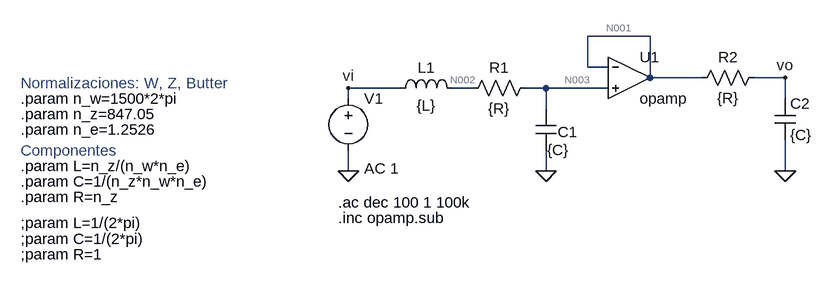
[diagram p0: schematic Tp-Semana3.asc]
Tp-Semana3.asc, the LTspice schematic file:
Version 4
SHEET 1 880 680
WIRE 288 64 192 64
WIRE 192 112 192 64
WIRE 224 112 192 112
WIRE 288 128 288 64
WIRE 368 128 288 128
WIRE 496 128 448 128
WIRE -96 144 -176 144
WIRE 16 144 -16 144
WIRE 128 144 96 144
WIRE 224 144 128 144
WIRE -176 160 -176 144
WIRE 496 160 496 128
WIRE 128 176 128 144
WIRE -176 272 -176 240
WIRE 128 272 128 240
WIRE 496 272 496 224
FLAG 496 128 vo
FLAG -176 144 vi
FLAG 496 272 0
FLAG -176 272 0
FLAG 128 272 0
SYMBOL ind -112 160 R270
WINDOW 0 32 56 VTop 2
WINDOW 3 5 56 VBottom 2
SYMATTR InstName L1
SYMATTR Value {L}
SYMBOL cap 112 176 R0
WINDOW 0 34 36 Left 2
WINDOW 3 18 63 Left 2
SYMATTR InstName C1
SYMATTR Value {C}
SYMBOL res 112 128 R90
WINDOW 3 32 56 VTop 2
WINDOW 0 0 56 VBottom 2
SYMATTR Value {R}
SYMATTR InstName R1
SYMBOL voltage -176 144 R0
WINDOW 123 24 124 Left 2
WINDOW 39 0 0 Left 0
SYMATTR Value2 AC 1
SYMATTR InstName V1
SYMATTR Value ""
SYMBOL Opamps\\opamp 256 64 R0
SYMATTR InstName U1
SYMBOL res 464 112 R90
WINDOW 0 0 56 VBottom 2
WINDOW 3 32 56 VTop 2
SYMATTR InstName R2
SYMATTR Value {R}
SYMBOL cap 480 160 R0
SYMATTR InstName C2
SYMATTR Value {C}
TEXT -192 320 Left 2 !.ac dec 100 1 100k
TEXT -680 160 Left 2 !.param n_w=1500*2*pi
TEXT -680 184 Left 2 !.param n_z=847.05
TEXT -680 136 Left 2 ;Normalizaciones: W, Z, Butter
TEXT -680 264 Left 2 !.param L=n_z/(n_w*n_e)
TEXT -680 288 Left 2 !.param C=1/(n_z*n_w*n_e)
TEXT -680 240 Left 2 ;Componentes
TEXT -192 344 Left 2 !.inc opamp.sub
TEXT -680 208 Left 2 !.param n_e=1.2526
TEXT -680 312 Left 2 !.param R=n_z
TEXT -680 352 Left 2 !;param L=1/(2*pi)
TEXT -680 376 Left 2 !;param C=1/(2*pi)
TEXT -680 400 Left 2 !;param R=1

The netlist it stands for:
* Tp-Semana3.asc
L1 vi N002 {L}
C1 N003 0 {C}
R1 N003 N002 {R}
V1 vi 0 AC 1
XU1 N001 N003 N001 opamp Aol=100K GBW=10Meg  ; pins invin noninvin out
R2 vo N001 {R}
C2 vo 0 {C}
.ac dec 100 1 100k
.param n_w=1500*2*pi
.param n_z=847.05
* Normalizaciones: W, Z, Butter
.param L=n_z/(n_w*n_e)
.param C=1/(n_z*n_w*n_e)
* Componentes
.inc opamp.sub
.param n_e=1.2526
.param R=n_z
;param L=1/(2*pi)
;param C=1/(2*pi)
;param R=1
.backanno
.end

* Results of the author's LTspice run, read from the files saved beside the schematic
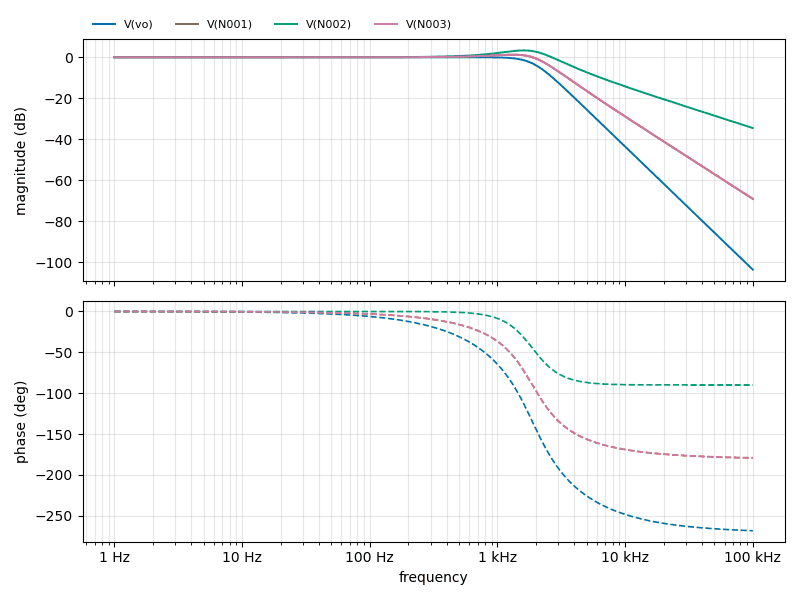
[diagram p1: AC Analysis of Tp-Semana3.asc, plotted from the saved traces]
* AC Analysis, 1 run:
*   V(vo): -0.00 dB at 1 Hz, -103.57 dB at 100 kHz, peak -0.00 dB at 1 Hz, 3 dB below the peak at 1.879 kHz
*   V(N001): -0.00 dB at 1 Hz, -69.04 dB at 100 kHz, peak 1.25 dB at 1.318 kHz, 3 dB below the peak at 2.196 kHz
*   V(N002): 0.00 dB at 1 Hz, -34.52 dB at 100 kHz, peak 3.33 dB at 1.622 kHz, 3 dB below the peak at 365.6 Hz and 2.583 kHz
*   V(N003): 0.00 dB at 1 Hz, -69.04 dB at 100 kHz, peak 1.25 dB at 1.318 kHz, 3 dB below the peak at 2.196 kHz